# Altium schematic sheet ESC.SchDoc
size A4
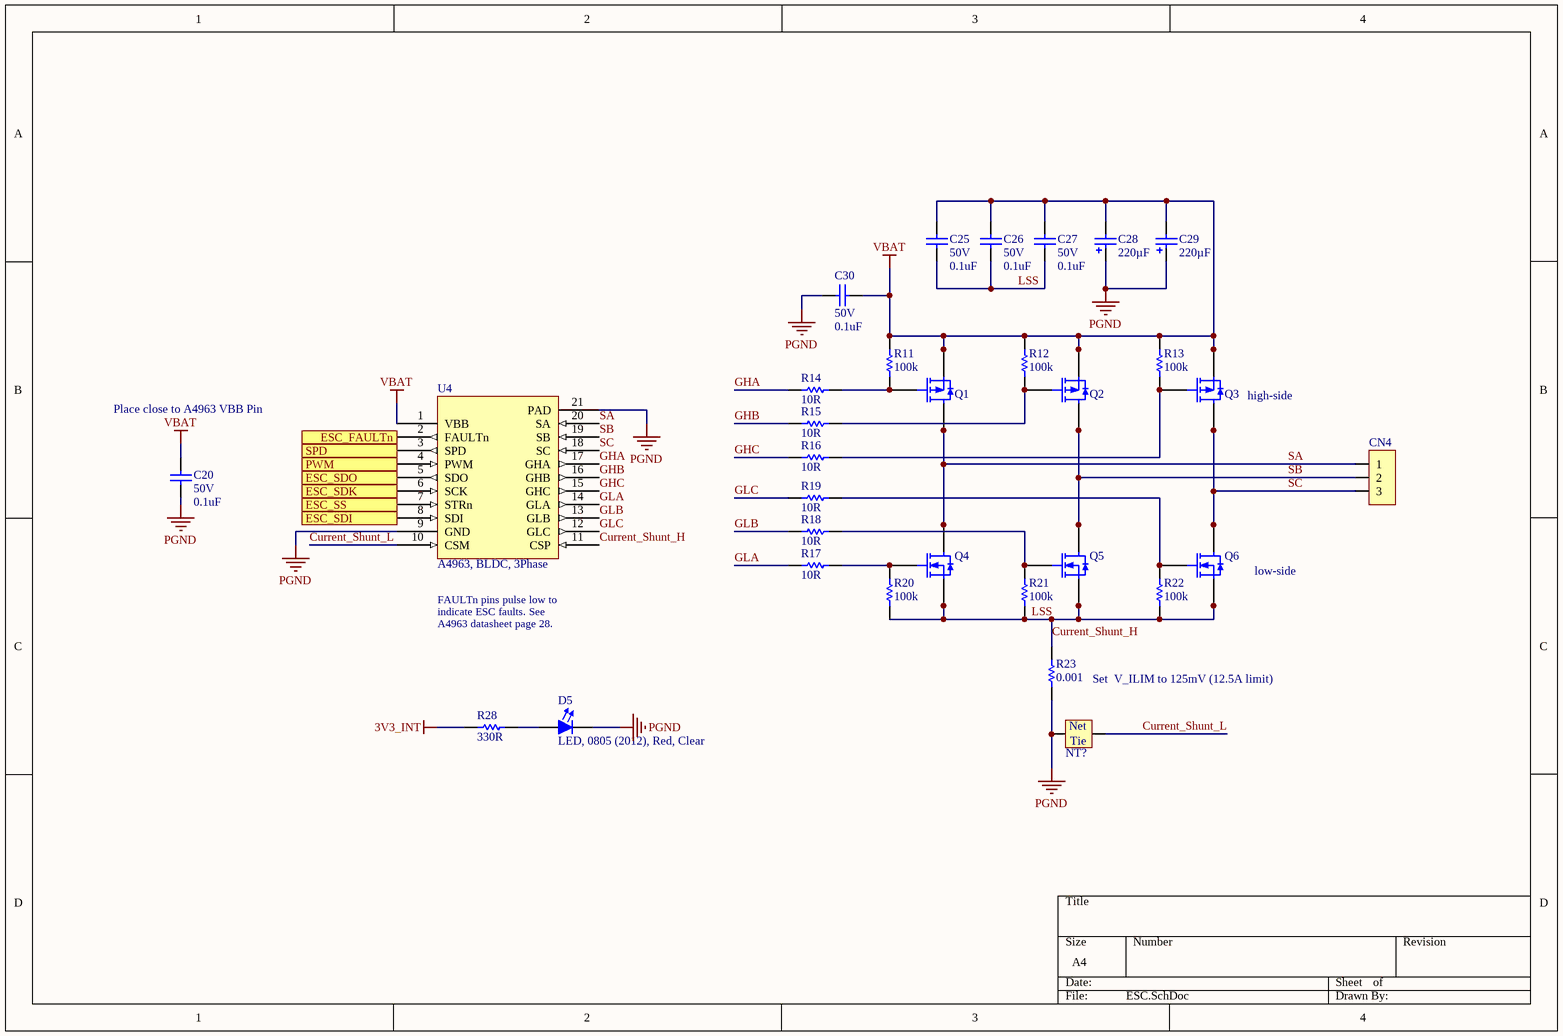
[diagram p0: ESC.SchDoc]

## Parts
C20  Voltage: 50V  Capacitance: 0.1uF  [FP-CL10-0_1-MFG]  (hidden comment: CL10B104JB8NNNC)
C25  Voltage: 50V  Capacitance: 0.1uF  [FP-CL10-0_1-MFG]  (hidden comment: CL10B104JB8NNNC)
C26  Voltage: 50V  Capacitance: 0.1uF  [FP-CL10-0_1-MFG]  (hidden comment: CL10B104JB8NNNC)
C27  Voltage: 50V  Capacitance: 0.1uF  [FP-CL10-0_1-MFG]  (hidden comment: CL10B104JB8NNNC)
C28  value 220µF  [Radial_CAN_8.3mm_10.5mm]  (hidden comment: 220uF, 50V, 20%, Alum, Polarized, SMD)
C29  value 220µF  [Radial_CAN_8.3mm_10.5mm]  (hidden comment: 220uF, 50V, 20%, Alum, Polarized, SMD)
C30  Voltage: 50V  Capacitance: 0.1uF  [FP-CL10-0_1-MFG]  (hidden comment: CL10B104JB8NNNC)
CN4  3x1, Terminal Block, Pitch: 5mm, Screw, THT  [3x1, Terminal Block, Pitch: 5mm, Screw, THT]  (value not drawn)
D5  LED, 0805 (2012), Red, Clear  [LED0805]
NT?  Net Tie, 20mil  [NETTIE_20mil]  (value not drawn)  (net tie, no BOM)
Q1  SI7625DN-T1-GE3  [PowerPAK 1212-8]  (value not drawn)
Q2  SI7625DN-T1-GE3  [PowerPAK 1212-8]  (value not drawn)
Q3  SI7625DN-T1-GE3  [PowerPAK 1212-8]  (value not drawn)
Q4  SIS476DN-T1-GE3  [PowerPAK 1212-8]  (value not drawn)
Q5  SIS476DN-T1-GE3  [PowerPAK 1212-8]  (value not drawn)
Q6  SIS476DN-T1-GE3  [PowerPAK 1212-8]  (value not drawn)
R11  value 100k  [RESC1608N(0603")]  (hidden comment: 100kR, 1%, 1/10W, 0603 SMD)
R12  value 100k  [RESC1608N(0603")]  (hidden comment: 100kR, 1%, 1/10W, 0603 SMD)
R13  value 100k  [RESC1608N(0603")]  (hidden comment: 100kR, 1%, 1/10W, 0603 SMD)
R14  Resistance: 10R  [FP-ERJ3EK-IPC_A]  (hidden comment: ERJ3EKF10R0V)
R15  Resistance: 10R  [FP-ERJ3EK-IPC_A]  (hidden comment: ERJ3EKF10R0V)
R16  Resistance: 10R  [FP-ERJ3EK-IPC_A]  (hidden comment: ERJ3EKF10R0V)
R17  Resistance: 10R  [FP-ERJ3EK-IPC_A]  (hidden comment: ERJ3EKF10R0V)
R18  Resistance: 10R  [FP-ERJ3EK-IPC_A]  (hidden comment: ERJ3EKF10R0V)
R19  Resistance: 10R  [FP-ERJ3EK-IPC_A]  (hidden comment: ERJ3EKF10R0V)
R20  value 100k  [RESC1608N(0603")]  (hidden comment: 100kR, 1%, 1/10W, 0603 SMD)
R21  value 100k  [RESC1608N(0603")]  (hidden comment: 100kR, 1%, 1/10W, 0603 SMD)
R22  value 100k  [RESC1608N(0603")]  (hidden comment: 100kR, 1%, 1/10W, 0603 SMD)
R23  value 0.001  [RESC6332N(2512")]  (hidden comment: CSRL3-0R001F8)
R28  Resistance: 330R  [FP-CRCW0603-e3-IPC_C]  (hidden comment: CRCW0603330RFKEA)
U4  A4963, BLDC, 3Phase  [TSOP65P640X120_HS-21M]

## Ports
ESC_FAULTn, ESC_SDI, ESC_SDK, ESC_SDO, ESC_SS, PWM, SPD

## Nets
3V3_INT: R28.1
PGND: C20.1 C28.1(Anode) C29.1(Anode) C30.1 D5.1(Cathode) NT?.1 R23.1 U4.9(GND) U4.21(PAD)
VBAT: C20.2 C25.2 C26.2 C27.2 C28.2(Cathode) C29.2(Cathode) C30.2 Q1.1(Source) Q1.2(Source) Q1.3(Source) Q2.1(Source) Q2.2(Source) Q2.3(Source) Q3.1(Source) Q3.2(Source) Q3.3(Source) R11.2 R12.2 R13.2 U4.1(VBB)
Current_Shunt_H: C25.1 C26.1 C27.1 Q4.1(Source) Q4.2(Source) Q4.3(Source) Q5.1(Source) Q5.2(Source) Q5.3(Source) Q6.1(Source) Q6.2(Source) Q6.3(Source) R20.1 R21.1 R22.1 R23.2 U4.11(CSP)  [also labelled LSS]
Current_Shunt_L: NT?.2 U4.10(CSM)
ESC_FAULTn: U4.2(FAULTn) ; port ESC_FAULTn
ESC_SDI: U4.8(SDI) ; port ESC_SDI
ESC_SDK: U4.6(SCK) ; port ESC_SDK
ESC_SDO: U4.5(SDO) ; port ESC_SDO
ESC_SS: U4.7(STRn) ; port ESC_SS
GHA: R14.1 U4.17(GHA)
GHB: R15.1 U4.16(GHB)
GHC: R16.1 U4.15(GHC)
GLA: R17.1 U4.14(GLA)
GLB: R18.1 U4.13(GLB)
GLC: R19.1 U4.12(GLC)
PWM: U4.4(PWM) ; port PWM
SA: CN4.1 Q1.5(Drain) Q1.6(Drain) Q1.7(Drain) Q1.8(Drain) Q1.9(Drain) Q4.5(Drain) Q4.6(Drain) Q4.7(Drain) Q4.8(Drain) Q4.9(Drain) U4.20(SA)
SB: CN4.2 Q2.5(Drain) Q2.6(Drain) Q2.7(Drain) Q2.8(Drain) Q2.9(Drain) Q5.5(Drain) Q5.6(Drain) Q5.7(Drain) Q5.8(Drain) Q5.9(Drain) U4.19(SB)
SC: CN4.3 Q3.5(Drain) Q3.6(Drain) Q3.7(Drain) Q3.8(Drain) Q3.9(Drain) Q6.5(Drain) Q6.6(Drain) Q6.7(Drain) Q6.8(Drain) Q6.9(Drain) U4.18(SC)
SPD: U4.3(SPD) ; port SPD
NetD5_2: D5.2(Anode) R28.2
NetQ1_4: Q1.4(Gate) R11.1 R14.2
NetQ2_4: Q2.4(Gate) R12.1 R15.2
NetQ3_4: Q3.4(Gate) R13.1 R16.2
NetQ4_4: Q4.4(Gate) R17.2 R20.2
NetQ5_4: Q5.4(Gate) R18.2 R21.2
NetQ6_4: Q6.4(Gate) R19.2 R22.2

## Notes on the sheet
- Place close to A4963 VBB Pin
- (near Q3) high-side
- (near Q6) low-side
- (near U4) FAULTn pins pulse low to indicate ESC faults. See A4963 datasheet page 28.
- Set  V_ILIM to 125mV (12.5A limit)
- (in symbol CMP-053-0006-1) Net; Tie

## Library data of the parts
C20 C25-C27 C30 = CMP-00000-3: CAP CER 0.1UF 50V X7R 0603; Tolerance: 5%; Material: Ceramic; Case Code (Imperial): 0603; Mount: Surface Mount; Thickness: 0.035inch; Depth: 0.8mm; Packaging: Tape and Reel; Package Quantity: 1; Dielectric: X7R; Height: 0.8mm; Radiation Hardening: No; Max Operating Temperature: 125°C; Voltage Rating: 50V; Case/Package: 0603; Min Operating Temperature: -55°C; Case Code (Metric): 1608; Length: 1.6mm; Contact Plating: Tin; Width: 0.031inch
C28 C29 = CMP-006-0034-1: Capacitor, Polarized, Aluminum, 50V; Pin Count: 2; Component Type: Standard; Publisher: AUVic; Source: AUVic_Schematic_Library_Capacitors.SchLib; Design Item ID: 220uF, 50V, 20%, Alum, Polarized, SMD; Date Created: 2016-06-25; Created By: Ashwin Sira; PackageDescription: Can
CN4 = CMP-005-0011-1: Source: AUVic_Schematic_Library_Connectors.SchLib; Last Updated: *; Publisher: AUVic, Ashwin Sira; Date Published: 2014-06-03; Component Type: Standard; Reviewed By: *; Design Item ID: 3x1, Terminal Block, Pitch: 5mm, Screw, THT; Pin Count: 3
D5 = CMP-057-0011-2: Design Item ID: LED, 0805 (2012), Red, Clear; Colour: Red; Component Type: Standard; Pin Count: 2; Created By: Ashwin Sira; Source: AUVic_Schematic_Library_Diodes.SchLib
NT? = CMP-053-0006-1: Net Tie, 20mil by 20mil; Size: 0.254mm x 0.508mm; Design Item ID: Net Tie, 20mil; Publisher: AUVic; Pin Count: 2; Source: AUVic_Integrated_Library_Virtual_Components.SchLib; Created By: Ashwin Sira; Date Created: 2016-06-17; Component Type: Net Tie
Q1-Q3 = CMP-052-0024-1: P-Channel 30V 35A (Tc) 3.7W (Ta), 52W (Tc) Surface Mount PowerPAK® 1212-8; Source: AUVic_Schematic_Library_Transistors.SchLib; Component Type: Standard; Created By: Poorna Chander Kalidas; Design Item ID: SI7625DN-T1-GE3; Pin Count: 9
Q4-Q6 = CMP-052-0025-1: N-Channel 30V 40A (Tc) 3.7W (Ta), 52W (Tc) Surface Mount PowerPAK® 1212-8; Design Item ID: SIS476DN-T1-GE3; ComponentLink1URL: https://www.digikey.ca/product-detail/en/diodes-incorporated/DMN3023L-7/DMN3023L-7DICT-ND/5453155; Source: AUVic_Schematic_Library_Transistors.SchLib; ComponentLink1Description: Digi-Key; Pin Count: 9; Created By: Poorna Chander Kalidas; Component Type: Standard
R11-R13 R20-R22 = CMP-047-0010-1: Made By: Andy Bates; Owned By: AUVic; Component Type: Standard; Pin Count: 2; Design Item ID: 100kR, 1%, 1/10W, 0603 SMD; Source: AUVic_Schematic_Library_Resistors.SchLib; Last Edited: 14-06-30; Created On: 14-06-30
R14-R19 = CMP-00034-2: PANASONIC - ERJ3EKF10R0V - SMD Chip Resistor, 0603 [1608 Metric], 10 ohm, ERJ3EK Series, 75 V, Thick Film, 100 mW; Temperature Coefficient: 100ppm/°C; Tolerance: 1%; Max Power Dissipation: 100mW; Voltage Rating (DC): 75V; Package Quantity: 5000; Case Code (Imperial): 0603; Military Standard: Not; Depth: 0.8mm; Number of Terminations: 2; Working Voltage: 75V; Min Operating Temperature: -55°C; Width: 0.8mm; Composition: Thick Film; Packaging: Tape and Reel; Power Rating: 100mW; REACH SVHC: No SVHC; Max Operating Temperature: 155°C; Case Code (Metric): 1608; Features: Automotive AEC-Q200; Case/Package: 0603; Length: 1.6mm; Number of Pins: 2; Lead Free: Lead Free; Height: 0.45mm; Voltage Rating: 75V; Contact Plating: Tin; Termination: SMD/SMT; Mount: Surface Mount; Radiation Hardening: No
R23 = CMP-009-00000-2: Res 0.001 Ohm 1% 3W 2512
R28 = CMP-00067-2: Res Thick Film 0603 330 Ohm 1% 0.1W(1/10W) +/-100ppm/ßC Pad SMD Automotive T/R; Voltage Rating (DC): 75V; Power Rating: 100mW; Temperature Coefficient: 100ppm/°C; Contact Plating: Tin; Package Quantity: 10; Tolerance: 1%; Packaging: Tape and Reel; Case/Package: 0603; Max Operating Temperature: 155°C; Case Code (Metric): 1608; Case Code (Imperial): 0603; Min Operating Temperature: -55°C; Length: 1.55mm; Height: 0.45mm; Lead Free: Lead Free; Termination: SMD/SMT; Voltage Rating: 75V; Composition: Thick Film; Weight: 7.1E-05oz; Military Standard: Not; Max Power Dissipation: 100mW; REACH SVHC: Unknown; Mount: Surface Mount; Depth: 0.85mm; Features: Automotive AEC-Q200; Number of Terminations: 2; Radiation Hardening: No; Width: 0.033inch
U4 = CMP-041-0002-1: A4963, BLDC, 3 Phase, Sensorless; Pin Count: 21; Component Type: Standard; Source: AUVic_Schematic_Library_Motor_Controllers.SchLib; Created By: Poorna Chander Kalidas; Design Item ID: A4963, BLDC, 3Phase